# EAGLE design grizzly_bear_jig (EAGLE 6.5.0)
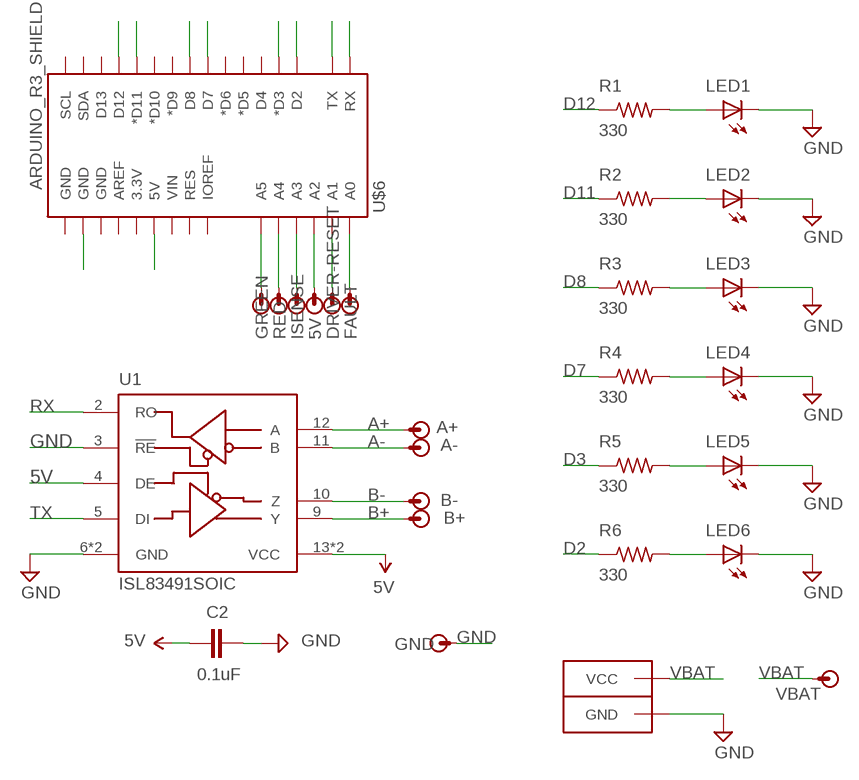
[diagram p0: schematic, sheet 1]

## Parts
5V  POGO_PIN  [POGO_PIN_394]
A+  POGO_PIN  [POGO_PIN_394]
A-  POGO_PIN  [POGO_PIN_394]
B+  POGO_PIN  [POGO_PIN_394]
B-  POGO_PIN  [POGO_PIN_394]
C2  0.1uF  0.1UF-25V(+80/-20%)(0603)  [0603-CAP]
CONN1  ANDERSONHORIZONTAL  [ANDERSON_HORIZONTAL]
DRIVER-RESET  POGO_PIN  [POGO_PIN_394]
FAULT  POGO_PIN  [POGO_PIN_394]
GND  POGO_PIN  [POGO_PIN_394]
GREEN  POGO_PIN  [POGO_PIN_394]
ISENSE  POGO_PIN  [POGO_PIN_394]
LED1  LED0805  [LED-0805]
LED2  LED0805  [LED-0805]
LED3  LED0805  [LED-0805]
LED4  LED0805  [LED-0805]
LED5  LED0805  [LED-0805]
LED6  LED0805  [LED-0805]
R1  330  R-US_R0603  [R0603]
R2  330  R-US_R0603  [R0603]
R3  330  R-US_R0603  [R0603]
R4  330  R-US_R0603  [R0603]
R5  330  R-US_R0603  [R0603]
R6  330  R-US_R0603  [R0603]
RED  POGO_PIN  [POGO_PIN_394]
U1  ISL83491SOIC  [SOIC14]
U$6  ARDUINO_R3_SHIELD  [UNO_R3_SHIELD]
VBAT  POGO_PIN  [POGO_PIN_394]

## Nets
5V: C2.1 U1.4(DE) U1.13(VCC) U1.14(VCC) U$6.5V
A+: A+.POGO_PIN U1.12(A)
A-: A-.POGO_PIN U1.11(B)
B+: B+.POGO_PIN U1.9(Y)
B-: B-.POGO_PIN U1.10(Z)
D2: R6.1 U$6.D2
D3: R5.1 U$6.D3(*D3)
D7: R4.1 U$6.D7
D8: R3.1 U$6.D8
D11: R2.1 U$6.D11(*D11)
D12: R1.1 U$6.D12
GND: C2.2 CONN1.PIN1(GND) GND.POGO_PIN LED1.C LED2.C LED3.C LED4.C LED5.C LED6.C U1.3(!RE) U1.6(GND) U1.7(GND) U$6.GND@1(GND)
N$1: LED5.A R5.2
N$2: LED6.A R6.2
N$3: GREEN.POGO_PIN U$6.A5
N$4: RED.POGO_PIN U$6.A4
N$5: ISENSE.POGO_PIN U$6.A3
N$6: 5V.POGO_PIN U$6.A2
N$7: DRIVER-RESET.POGO_PIN U$6.A1
N$8: LED1.A R1.2
N$9: LED2.A R2.2
N$10: LED3.A R3.2
N$11: LED4.A R4.2
N$13: FAULT.POGO_PIN U$6.A0
RX: U1.2(RO) U$6.RX
TX: U1.5(DI) U$6.TX
VBAT: CONN1.PIN2(VCC) VBAT.POGO_PIN
Unconnected: U$6.3.3V U$6.AREF U$6.D4 U$6.D5(*D5) U$6.D6(*D6) U$6.D9(*D9) U$6.D10(*D10) U$6.D13 U$6.GND@0(GND) U$6.GND@2(GND) U$6.IOREF U$6.RES U$6.SCL U$6.SDA U$6.VIN

## Library data of the parts
5V A+ A- B+ B- DRIVER-RESET FAULT GND GREEN ISENSE RED VBAT = pie:POGO_PIN: Pogo Pin Mounting/Probing Pad; PIE-INT-REF-NUM: POGO-PIN
C2 = SparkFun-Capacitors:0.1UF-25V(+80/-20%)(0603): CAP-00810 Ceramic Standard decoupling cap; PROD_ID: CAP-00810
CONN1 = pie:ANDERSON: 2-pin 25A Anderson Connector http://www.alliedelec.com/images/products/datasheets/bm/ANDERSON_POWER_PRODUCTS/70162018.pdf; PIE-INT-REF-NUM: Anderson
LED1-LED6 = pie:LED: LEDs Standard schematic elements and footprints for 5mm, 3mm, 1206, and 0603 sized LEDs. 5mm - Spark Fun Electronics SKU : COM-00529 (and others); PIE-INT-REF-NUM: LED
R1-R6 = pie:R-US_: RESISTOR, American symbol; PIE-INT-REF-NUM: RESISTOR-GENERIC
U1 = pie:ISL83491; PIE-INT-REF-NUM: rs485_491
U$6 = SparkFun-Boards:ARDUINO_R3_SHIELD: Shield form compatible with the Arduino Uno R3.

## Board
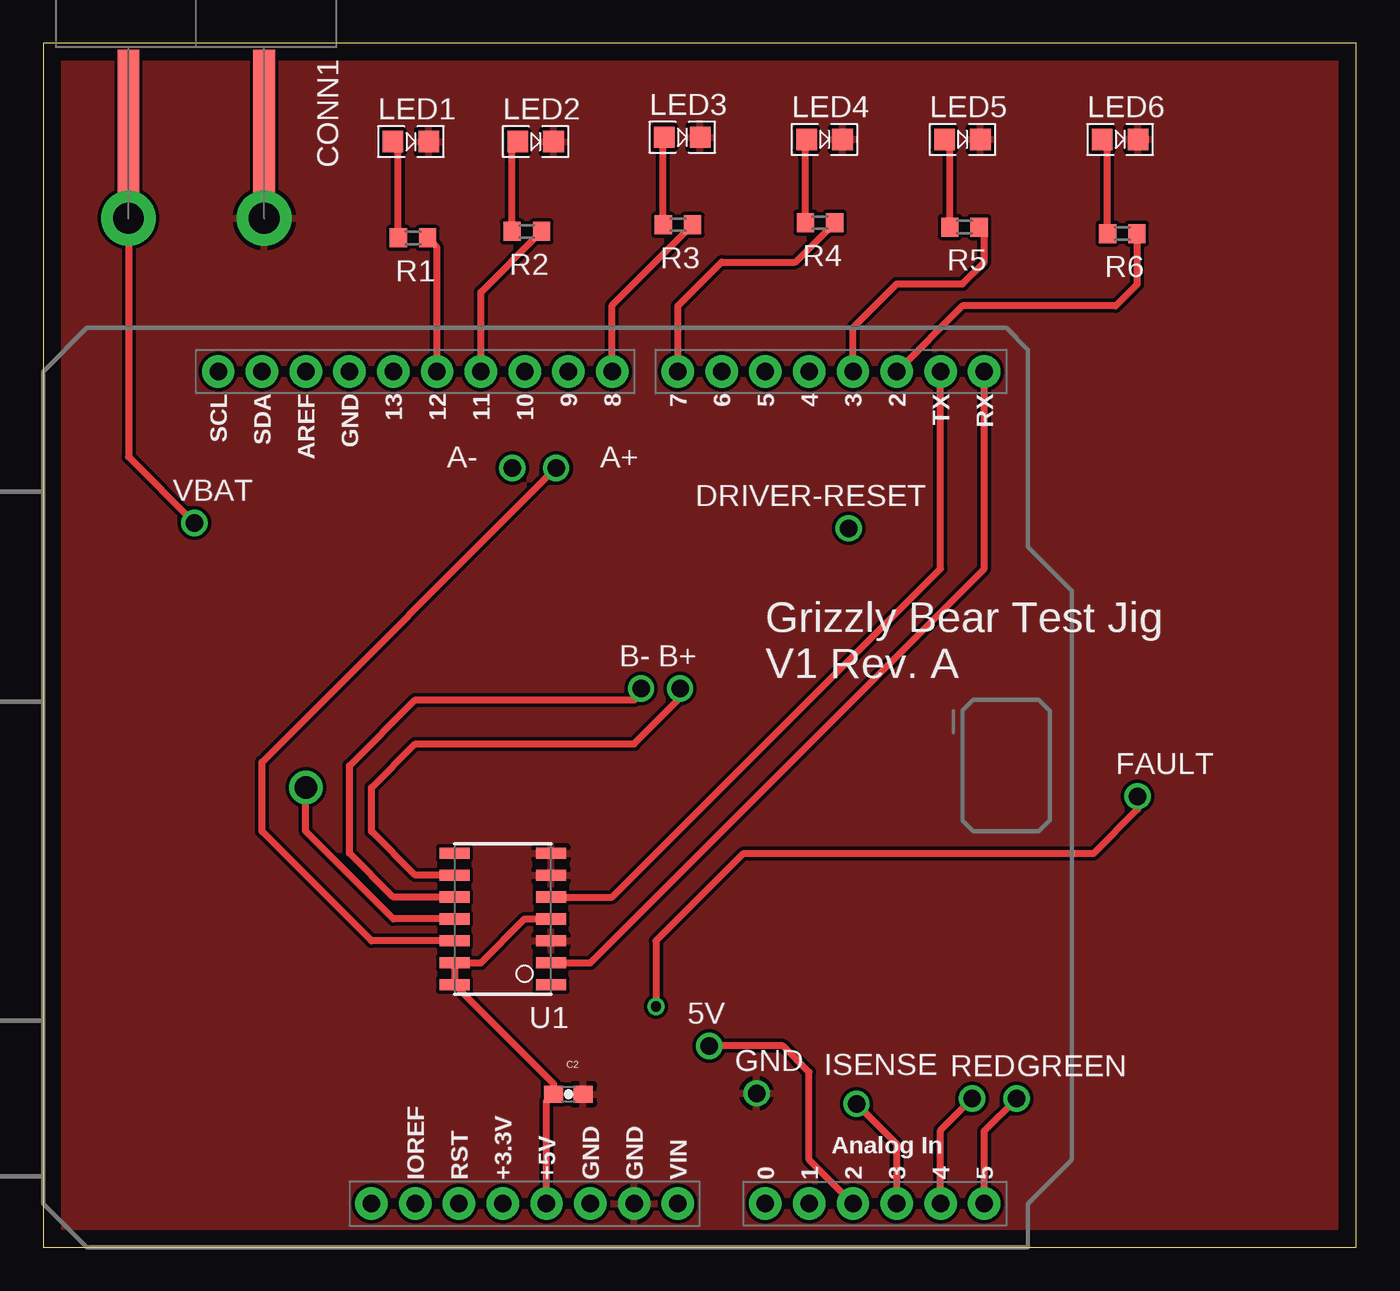
[diagram p1: board, top side]
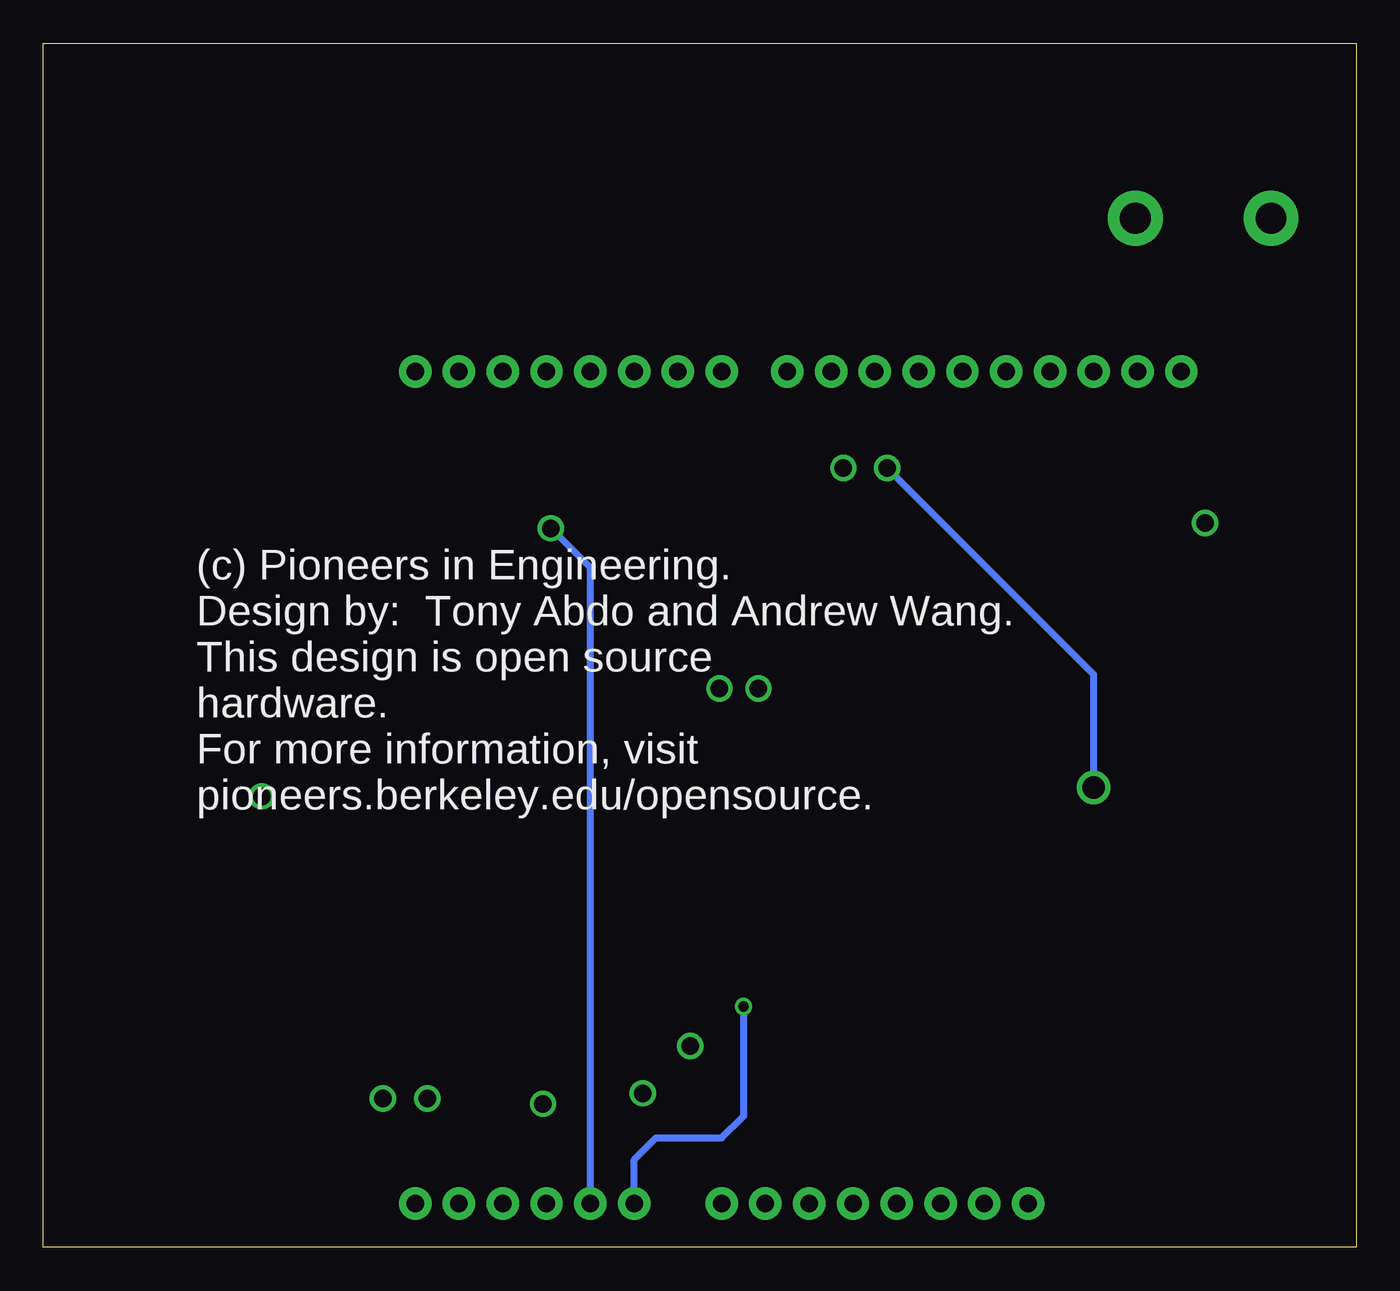
[diagram p2: board, bottom side, seen from below]

Size 76.2 x 69.85 mm. Coordinates in mm from the lower left corner, seen from the top.
Outline: 0,0 76.2,0 76.2,69.85 0,69.85 0,0
Copper layers (1*16): Top 0.035mm / dielectric 1.5mm / GND 0.035mm
Design rules "default": minimum track width 10mil, minimum drill 24mil, track to track 8mil, track to pad 8mil, pad to pad 8mil, via to via 8mil, smd to smd 8mil, copper to edge 40mil, drill to drill 8mil, minimum pad ring 10mil, minimum via ring 8mil, stop-mask expansion 4mil, vias tented up to drill 0mil, thermal gap 10mil

### Footprints (pad centres in the part's own frame; a part is rotated, then mirrored left to right if it is on the bottom)
POGO_PIN_394 = drill 1.016 pad 1.524: POGO_PIN 0,0
0603-CAP = smd 1.1 x 1: 1 -0.85,0; 2 0.85,0
ANDERSON_HORIZONTAL = smd 8.89 x 1.27: P$1 -5.334,3.937; P$3 -5.334,-3.937 | drill 1.778 pad 3.175: PIN1 0,3.937; PIN2 0,-3.937
LED-0805 = smd 1.194 x 1.245: A -1.041,0; C 1.041,0
R0603 = smd 1 x 1.1: 1 -0.85,0; 2 0.85,0
SOIC14 = smd 1.75 x 0.65: 1 -2.8,3.81; 2 -2.8,2.54; 3 -2.8,1.27; 4 -2.8,0; 5 -2.8,-1.27; 6 -2.8,-2.54; 7 -2.8,-3.81; 8 2.8,-3.81; 9 2.8,-2.54; 10 2.8,-1.27; 11 2.8,0; 12 2.8,1.27; 13 2.8,2.54; 14 2.8,3.81
UNO_R3_SHIELD = drill 1.016 pad 1.88: 3.3V 50.8,26.67; 5V 50.8,29.21; A0 50.8,41.91; A1 50.8,44.45; A2 50.8,46.99; A3 50.8,49.53; A4 50.8,52.07; A5 50.8,54.61; AREF 2.54,15.24; D2 2.54,49.53; D3 2.54,46.99; D4 2.54,44.45; D5 2.54,41.91; D6 2.54,39.37; D7 2.54,36.83; D8 2.54,33.02; D9 2.54,30.48; D10 2.54,27.94; D11 2.54,25.4; D12 2.54,22.86; D13 2.54,20.32; GND@0 50.8,31.75; GND@1 50.8,34.29; GND@2 2.54,17.78; IOREF 50.8,21.59; NC 50.8,19.05; RES 50.8,24.13; RX 2.54,54.61; SCL 2.54,10.16; SDA 2.54,12.7; TX 2.54,52.07; VIN 50.8,36.83

### Placement (x,y rotation side)
5V  38.66,11.68 0 top
A+  29.77,45.21 0 top
A-  27.23,45.21 0 top
B+  36.96,32.41 0 top
B-  34.7,32.41 0 top
C2  30.48,8.89 0 top
CONN1  8.89,59.69 270 top
DRIVER-RESET  46.74,41.71 0 top
FAULT  63.5,26.16 0 top
GND  41.4,8.94 0 top
GREEN  56.49,8.64 0 top
ISENSE  47.19,8.33 0 top
LED1  21.34,64.14 0 top
LED2  28.57,64.14 0 top
LED3  37.08,64.39 0 top
LED4  45.34,64.26 0 top
LED5  53.34,64.26 0 top
LED6  62.48,64.26 0 top
R1  21.46,58.55 180 top
R2  28.07,58.93 180 top
R3  36.83,59.31 180 top
R4  45.09,59.44 180 top
R5  53.47,59.18 180 top
R6  62.61,58.8 180 top
RED  53.9,8.64 0 top
U1  26.67,19.05 180 top
U$6  0,53.34 270 top
VBAT  8.79,42.01 0 top

### Tracks (layer width: path | path; a pad name or v marks a point on that pad's centre or on a via)
5V
  Top 0.406: U$6.5V 29.21,8.47 C2.1 29.63,9.48 U1.14 U1.13 | 24.13,16.51 U1.13 | U1.13 25.4,16.51 27.94,19.05 U1.4
A+
  Top 0.406: U1.12 19.05,17.78 12.7,24.13 12.7,28.14 A+.POGO_PIN
A-  (via drill 1.3)
  Top 0.406: U1.11 20.32,19.05 15.24,24.13 v15.24,26.67
  GND 0.406: v15.24,26.67 15.24,33.22 A-.POGO_PIN
B+
  Top 0.406: U1.9 21.59,21.59 19.05,24.13 19.05,26.67 21.59,29.21 34.29,29.21 36.83,31.75 36.83,32.41 B+.POGO_PIN
B-
  Top 0.406: U1.10 20.32,20.32 17.78,22.86 17.78,27.94 21.59,31.75 34.29,31.75 34.29,32 B-.POGO_PIN
D2
  Top 0.406: R6.1 63.46,55.84 62.23,54.61 53.34,54.61 U$6.D2
D3
  Top 0.406: U$6.D3 46.99,53.34 49.53,55.88 53.34,55.88 54.61,57.15 54.61,58.89 R5.1
D7
  Top 0.406: U$6.D7 36.83,54.61 39.37,57.15 43.65,57.15 R4.1
D8
  Top 0.406: U$6.D8 33.02,54.65 R3.1
D11
  Top 0.406: U$6.D11 25.4,55.41 R2.1
D12
  Top 0.406: U$6.D12 22.86,58 R1.1
GND
  pour Top: 0,0 0,69.85 76.2,69.85 76.2,0
N$1
  Top 0.406: R5.2 52.62,63.94 LED5.A
N$2
  Top 0.406: R6.2 61.76,63.94 LED6.A
N$3
  Top 0.406: U$6.A5 54.61,6.76 GREEN.POGO_PIN
N$4
  Top 0.406: U$6.A4 52.07,6.81 RED.POGO_PIN
N$5
  Top 0.406: U$6.A3 49.53,5.99 ISENSE.POGO_PIN
N$6
  Top 0.406: U$6.A2 44.45,5.08 44.45,10.16 42.93,11.68 5V.POGO_PIN
N$7
  GND 0.406: U$6.A1 44.45,39.42 DRIVER-RESET.POGO_PIN
N$8
  Top 0.406: R1.2 20.61,63.82 LED1.A
N$9
  Top 0.406: R2.2 27.22,63.82 LED2.A
N$10
  Top 0.406: R3.2 35.98,64.33 LED3.A
N$11
  Top 0.406: R4.2 44.23,64.2 LED4.A
N$13  (via drill 0.6)
  Top 0.406: FAULT.POGO_PIN 63.5,25.4 60.96,22.86 40.64,22.86 35.56,17.78 v35.56,13.97
  GND 0.406: U$6.A0 41.91,5.08 40.64,6.35 36.83,6.35 35.56,7.62 v35.56,13.97
RX
  Top 0.406: U1.2 31.75,16.51 54.61,39.37 U$6.RX
TX
  Top 0.406: U1.5 33.02,20.32 52.07,39.37 U$6.TX
VBAT
  Top 0.406: CONN1.PIN2 4.95,45.85 VBAT.POGO_PIN

### Text on the board
tPlace: Grizzly Bear Test Jig / V1 Rev. A
bPlace: (c) Pioneers in Engineering. / Design by: Tony Abdo and Andrew Wang. / This design is open source / hardware. / For more information, visit / pioneers.berkeley.edu/opensource.